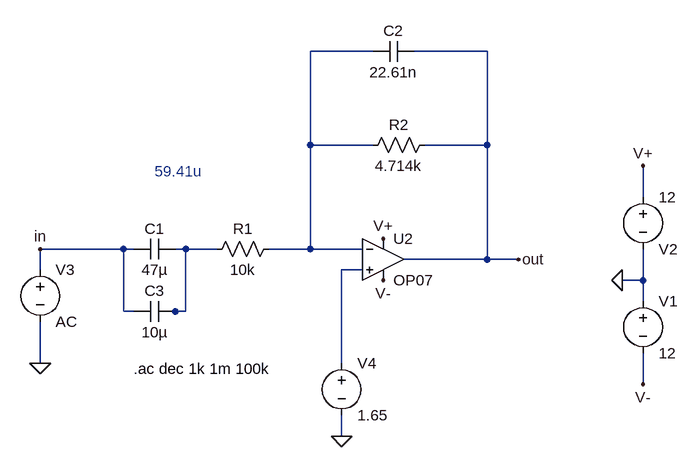
[diagram p0: schematic lab1anal.asc]
lab1anal.asc, the LTspice schematic file:
Version 4
SHEET 1 880 680
WIRE 144 -144 48 -144
WIRE 320 -144 208 -144
WIRE 48 0 48 -144
WIRE 144 0 48 0
WIRE 320 0 320 -144
WIRE 320 0 224 0
WIRE 560 80 560 32
WIRE -240 160 -368 160
WIRE -224 160 -240 160
WIRE -144 160 -160 160
WIRE -96 160 -144 160
WIRE 48 160 48 0
WIRE 48 160 -16 160
WIRE 128 160 48 160
WIRE 320 176 320 0
WIRE 320 176 192 176
WIRE 368 176 320 176
WIRE -368 192 -368 160
WIRE 128 192 96 192
WIRE 560 208 560 160
WIRE 560 208 528 208
WIRE 560 240 560 208
WIRE -240 256 -240 160
WIRE -224 256 -240 256
WIRE -160 256 -176 256
WIRE -144 256 -144 160
WIRE -144 256 -160 256
WIRE -368 336 -368 272
WIRE 96 336 96 192
WIRE 560 368 560 320
WIRE 96 448 96 416
FLAG 368 176 out
FLAG -368 336 0
FLAG 528 208 0
FLAG 560 32 V+
FLAG 560 368 V-
FLAG 160 208 V-
FLAG 160 144 V+
FLAG 96 448 0
FLAG -368 160 in
SYMBOL res 0 144 R90
WINDOW 0 0 56 VBottom 2
WINDOW 3 32 56 VTop 2
SYMATTR InstName R1
SYMATTR Value 10k
SYMBOL cap -160 144 R90
WINDOW 0 0 32 VBottom 2
WINDOW 3 32 32 VTop 2
SYMATTR InstName C1
SYMATTR Value 47µ
SYMBOL res 240 -16 R90
WINDOW 0 0 56 VBottom 2
WINDOW 3 32 56 VTop 2
SYMATTR InstName R2
SYMATTR Value 4.714k
SYMBOL cap 208 -160 R90
WINDOW 0 0 32 VBottom 2
WINDOW 3 32 32 VTop 2
SYMATTR InstName C2
SYMATTR Value 22.61n
SYMBOL Opamps\\OP07 160 112 R0
SYMATTR InstName U2
SYMBOL voltage 96 320 R0
WINDOW 123 0 0 Left 0
WINDOW 39 0 0 Left 0
SYMATTR InstName V4
SYMATTR Value 1.65
SYMBOL voltage 560 224 R0
WINDOW 123 0 0 Left 0
WINDOW 39 0 0 Left 0
SYMATTR InstName V1
SYMATTR Value 12
SYMBOL voltage 560 64 R0
WINDOW 0 24 96 Left 2
WINDOW 3 24 16 Left 2
WINDOW 123 0 0 Left 0
WINDOW 39 0 0 Left 0
SYMATTR InstName V2
SYMATTR Value 12
SYMBOL voltage -368 176 R0
WINDOW 123 0 0 Left 0
WINDOW 39 0 0 Left 0
SYMATTR InstName V3
SYMATTR Value AC
SYMBOL cap -160 240 R90
WINDOW 0 0 32 VBottom 2
WINDOW 3 32 32 VTop 2
SYMATTR InstName C3
SYMATTR Value 10µ
TEXT -224 344 Left 2 !.ac dec 1k 1m 100k
TEXT -192 40 Left 2 ;59.41u

The netlist it stands for:
* lab1anal.asc
R1 N001 N002 10k
C1 N002 in 47µ
R2 out N001 4.714k
C2 out N001 22.61n
XU2 N003 N001 V+ V- out LT1001  ; OP07, pins In+ In- V+ V- OUT
V4 N003 0 1.65
V1 0 V- 12
V2 V+ 0 12
V3 in 0 AC
C3 N002 in 10µ
.ac dec 1k 1m 100k
* 59.41u
.lib LTC.lib
.backanno
.end